# EAGLE schematic Alec_BatteryPack (EAGLE 9.0.1)
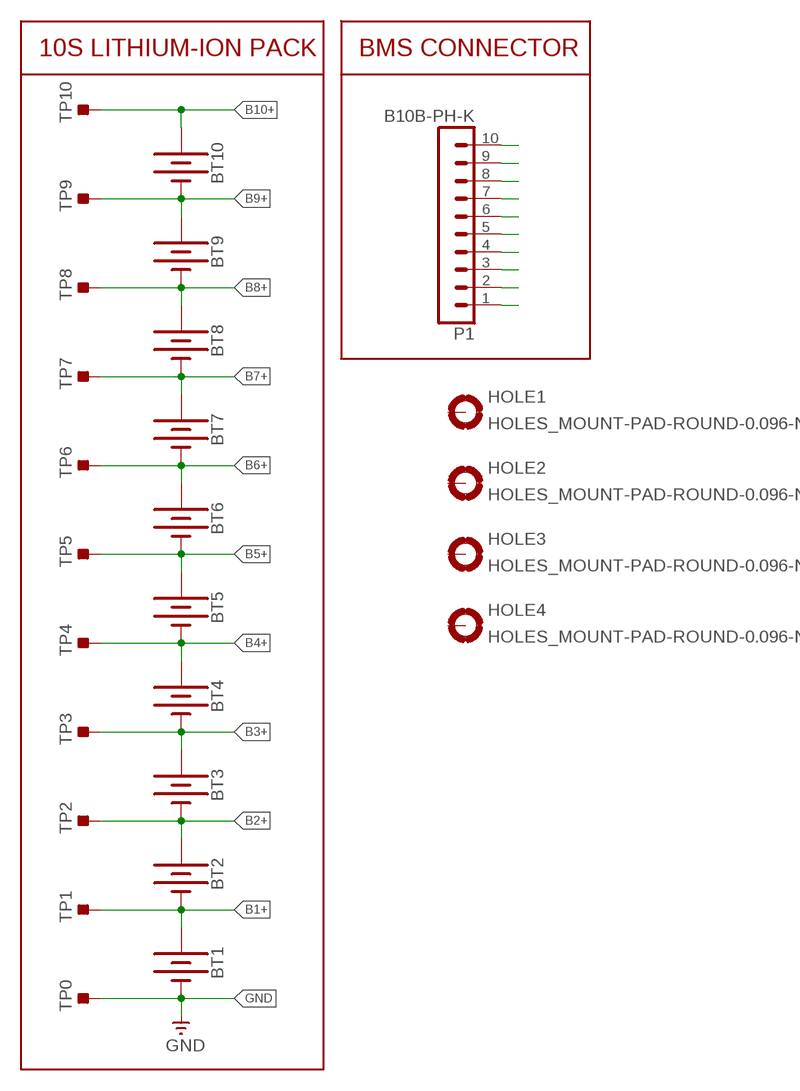
[diagram p0: schematic, sheet 1]

## Parts
BT1  BATTERY-18650  [BATTERY_18650-HOLDER]
BT2  BATTERY-18650  [BATTERY_18650-HOLDER]
BT3  BATTERY-18650  [BATTERY_18650-HOLDER]
BT4  BATTERY-18650  [BATTERY_18650-HOLDER]
BT5  BATTERY-18650  [BATTERY_18650-HOLDER]
BT6  BATTERY-18650  [BATTERY_18650-HOLDER]
BT7  BATTERY-18650  [BATTERY_18650-HOLDER]
BT8  BATTERY-18650  [BATTERY_18650-HOLDER]
BT9  BATTERY-18650  [BATTERY_18650-HOLDER]
BT10  BATTERY-18650  [BATTERY_18650-HOLDER]
HOLE1  HOLES_MOUNT-PAD-ROUND-0.096-NS  [HOLES_096-PAD-NS]
HOLE2  HOLES_MOUNT-PAD-ROUND-0.096-NS  [HOLES_096-PAD-NS]
HOLE3  HOLES_MOUNT-PAD-ROUND-0.096-NS  [HOLES_096-PAD-NS]
HOLE4  HOLES_MOUNT-PAD-ROUND-0.096-NS  [HOLES_096-PAD-NS]
P1  B10B-PH-K  [B10B-PH-K]
TP0  TESTPOINT_TPS-SMD-10SN  [TESTPOINT_SMD-10SN]
TP1  TESTPOINT_TPS-SMD-10SN  [TESTPOINT_SMD-10SN]
TP2  TESTPOINT_TPS-SMD-10SN  [TESTPOINT_SMD-10SN]
TP3  TESTPOINT_TPS-SMD-10SN  [TESTPOINT_SMD-10SN]
TP4  TESTPOINT_TPS-SMD-10SN  [TESTPOINT_SMD-10SN]
TP5  TESTPOINT_TPS-SMD-10SN  [TESTPOINT_SMD-10SN]
TP6  TESTPOINT_TPS-SMD-10SN  [TESTPOINT_SMD-10SN]
TP7  TESTPOINT_TPS-SMD-10SN  [TESTPOINT_SMD-10SN]
TP8  TESTPOINT_TPS-SMD-10SN  [TESTPOINT_SMD-10SN]
TP9  TESTPOINT_TPS-SMD-10SN  [TESTPOINT_SMD-10SN]
TP10  TESTPOINT_TPS-SMD-10SN  [TESTPOINT_SMD-10SN]

## Nets
B1+: BT1.PWR@1(+) BT2.GND@1(-) TP1.TP
B2+: BT2.PWR@1(+) BT3.GND@1(-) TP2.TP
B3+: BT3.PWR@1(+) BT4.GND@1(-) TP3.TP
B4+: BT4.PWR@1(+) BT5.GND@1(-) TP4.TP
B5+: BT5.PWR@1(+) BT6.GND@1(-) TP5.TP
B6+: BT6.PWR@1(+) BT7.GND@1(-) TP6.TP
B7+: BT7.PWR@1(+) BT8.GND@1(-) TP7.TP
B8+: BT8.PWR@1(+) BT9.GND@1(-) TP8.TP
B9+: BT9.PWR@1(+) BT10.GND@1(-) TP9.TP
B10+: BT10.PWR@1(+) TP10.TP
GND: BT1.GND@1(-) TP0.TP
N$1: P1.1
N$2: P1.2
N$3: P1.3
N$4: P1.4
N$5: P1.5
N$6: P1.6
N$7: P1.7
N$8: P1.8
N$9: P1.9
N$10: P1.10
Unconnected: HOLE1.B096(MOUNT) HOLE2.B096(MOUNT) HOLE3.B096(MOUNT) HOLE4.B096(MOUNT)

## Notes on the sheet
- 10S LITHIUM-ION PACK | BMS CONNECTOR

## Library data of the parts
BT1-BT10 = SparkFun-Batteries:BATTERY: Battery - Single Cell A variety of battery chemistries, sizes, and footprints. Device List: 20MM_PTH - Coin Cell Battery Holder - 20mm (PTH) <https://www.sparkfun.com/products/783> 6.8MM_PTH - Coin Cell Battery Holder - 6.8MM(SMD) <https://www.digikey.com/product-detail/en/seiko-instruments/MS621FE-FL11E/728-1057-ND/1889208?WT.srch=1&gclid=CNOQ5a6LzdQCFZS2wAodXCkE0g> 12MM_SMD - Coin Cell Battery Holder - 12mm (SMD) <https://www.sparkfun.com/products/10592> 12MM_PTH - Coin Cell Battery Holder - 12mm (PTH) <https://www.sparkfun.com/products/7948> 20MM_SMD - 20mm Coin Cell Battery Holder (SMD) (2 legs) Used on the Big Time Watch Kit <https://www.sparkfun.com/products/11734> 20MM_SMD_4LEGS - Coin Cell Battery Holder - 20mm (SMD) <https://www.sparkfun.com/products/11892> 20MM_SMD_4LEGS_OVERPASTE - Coin Cell Battery Holder - 20mm (SMD) <https://www.sparkfun.com/products/11892> (Over-paste on the legs) 24.5MM_PTH - Coin Cell Battery Holder - 24.5mm (PTH) <https://www.sparkfun.com/products/8863> 9V - 9V Battery Holder - PC Mount Used on the SparkFun SparkPunk Sound Kit <https://www.sparkfun.com/products/11177> and SparkFun SparkPunk Sequencer Kit <https://www.sparkfun.com/products/12707> 18650 - Battery Holder - 18650 (PTH) <https://www.sparkfun.com/products/13113> AA - Battery Holder - 1xAA (PTH) <https://www.sparkfun.com/products/7949> AAA - Battery Holder - 1xAAA (PTH) <https://www.sparkfun.com/products/12718> AA_KIT - Battery Holder - 1xAA (PTH) <https://www.sparkfun.com/products/7949> Special kit package - pads only have exposed copper on one side of the board. AAA_KIT - Battery Holder - 1xAAA (PTH) <https://www.sparkfun.com/products/12718> Special kit package - pads only have exposed copper on one side of the board.; PROD_ID: BATT-12327; SF_SKU: PRT-13113
HOLE1-HOLE4 = 52101-101-REV-A:HOLES_MOUNT-PAD-ROUND-: MOUNTING PAD, round; BOM: EXCLUDE
P1 = con-jst-ph:B10B-PH-K: HEADER
TP0 TP1-TP10 = 52101-101-REV-A:TESTPOINT_TPS: TEST POINT PAD; BOM: EXCLUDE